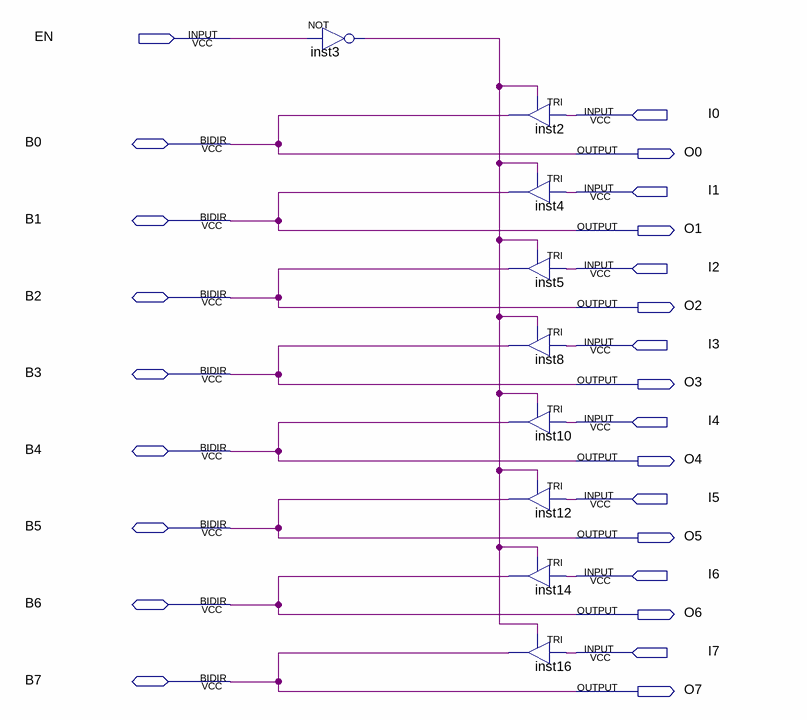
[diagram p0: schematic sheet]
// Quartus schematic 8bidir16x.bdf as structural Verilog: 9 symbols, 25 pins
module \8bidir16x  (
  input  EN,
  input  I0,
  input  I1,
  input  I2,
  input  I3,
  input  I4,
  input  I5,
  input  I6,
  input  I7,
  inout  B0,
  inout  B1,
  inout  B2,
  inout  B3,
  inout  B4,
  inout  B5,
  inout  B6,
  inout  B7,
  output O0,
  output O1,
  output O2,
  output O3,
  output O4,
  output O5,
  output O6,
  output O7
);

  wire inst3_out;

  not inst3 (inst3_out, EN);
  TRI inst2 (.IN(I0), .OE(inst3_out), .OUT(B0));
  TRI inst4 (.IN(I1), .OE(inst3_out), .OUT(B1));
  TRI inst5 (.IN(I2), .OE(inst3_out), .OUT(B2));
  TRI inst8 (.IN(I3), .OE(inst3_out), .OUT(B3));
  TRI inst10 (.IN(I4), .OE(inst3_out), .OUT(B4));
  TRI inst12 (.IN(I5), .OE(inst3_out), .OUT(B5));
  TRI inst14 (.IN(I6), .OE(inst3_out), .OUT(B6));
  TRI inst16 (.IN(I7), .OE(inst3_out), .OUT(B7));

  assign O0 = B0;
  assign O1 = B1;
  assign O2 = B2;
  assign O3 = B3;
  assign O4 = B4;
  assign O5 = B5;
  assign O6 = B6;
  assign O7 = B7;
endmodule
